# EAGLE design MPPC amp (EAGLE 7.1.0)
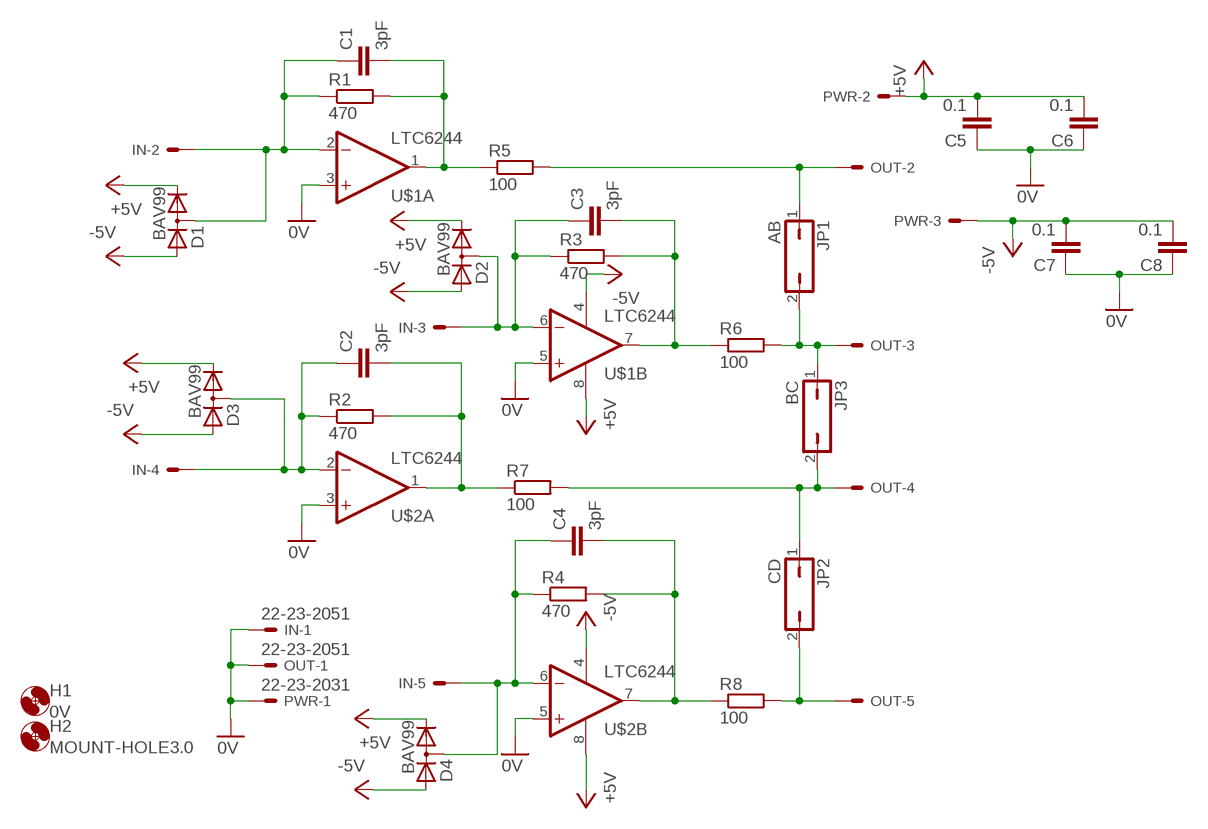
[diagram p0: schematic, sheet 1]

## Parts
C1  3pF  C-EUC0805  [C0805]
C2  3pF  C-EUC0805  [C0805]
C3  3pF  C-EUC0805  [C0805]
C4  3pF  C-EUC0805  [C0805]
C5  0.1  C-EUC0805  [C0805]
C6  0.1  C-EUC0805  [C0805]
C7  0.1  C-EUC0805  [C0805]
C8  0.1  C-EUC0805  [C0805]
D1  BAV99  [SOT23]
D2  BAV99  [SOT23]
D3  BAV99  [SOT23]
D4  BAV99  [SOT23]
H1  0V  MOUNT-HOLE3.0  [3,0]
H2  MOUNT-HOLE3.0  [3,0]
IN  22-23-2051  [22-23-2051]
JP1  AB  JP1Q  [JP1]
JP2  CD  JP1Q  [JP1]
JP3  BC  JP1Q  [JP1]
OUT  22-23-2051  [22-23-2051]
PWR  22-23-2031  [22-23-2031]
R1  470  R-EU_R0805  [R0805]
R2  470  R-EU_R0805  [R0805]
R3  470  R-EU_R0805  [R0805]
R4  470  R-EU_R0805  [R0805]
R5  100  R-EU_R0805  [R0805]
R6  100  R-EU_R0805  [R0805]
R7  100  R-EU_R0805  [R0805]
R8  100  R-EU_R0805  [R0805]
U$1  LTC6244  [MSOP08]
U$2  LTC6244  [MSOP08]

## Nets
0V: C5.1 C6.1 C7.1 C8.1 IN.1 OUT.1 PWR.1 U$1.3(A:+IN) U$1.5(B:+IN) U$2.3(A:+IN) U$2.5(B:+IN)
+5V: C5.2 C6.2 D1.2(C) D2.2(C) D3.2(C) D4.2(C) PWR.2 U$1.8(B:V+) U$2.8(B:V+)
-5V: C7.2 C8.2 D1.1(A) D2.1(A) D3.1(A) D4.1(A) PWR.3 U$1.4(B:V-) U$2.4(B:V-)
N$1: C4.1 D4.3(AC) IN.5 R4.1 U$2.6(B:-IN)
N$2: C2.1 D3.3(AC) IN.4 R2.1 U$2.2(A:-IN)
N$3: C3.1 D2.3(AC) IN.3 R3.1 U$1.6(B:-IN)
N$4: C1.1 D1.3(AC) IN.2 R1.1 U$1.2(A:-IN)
N$5: C1.2 R1.2 R5.1 U$1.1(A:OUT)
N$6: C2.2 R2.2 R7.1 U$2.1(A:OUT)
N$7: C3.2 R3.2 R6.1 U$1.7(B:OUT)
N$8: C4.2 R4.2 R8.1 U$2.7(B:OUT)
N$9: JP1.2 JP3.1 OUT.3 R6.2
N$10: JP1.1 OUT.2 R5.2
N$11: JP2.1 JP3.2 OUT.4 R7.2
N$12: JP2.2 OUT.5 R8.2

## Library data of the parts
C1-C8 = rcl:C-EU: CAPACITOR, European symbol
D1-D4 = custom_parts:BAV99: 200mA 70V High Conductance Ultra-fast Switching Diode
H1 H2 = holes:MOUNT-HOLE: MOUNTING HOLE with drill center marker
IN OUT = con-molex:22-23-2051: .100" (2.54mm) Center Header - 5 Pin; MF: MOLEX; MPN: 22-23-2051; OC_FARNELL: 1462952; OC_NEWARK: 38C9178
JP1-JP3 = jumper:JP1Q: JUMPER
PWR = con-molex:22-23-2031: .100" (2.54mm) Center Header - 3 Pin; MF: MOLEX; MPN: 22-23-2031; OC_FARNELL: 1462950; OC_NEWARK: 30C0862
R1-R8 = rcl:R-EU_: RESISTOR, European symbol
U$1 U$2 = custom_parts:LTC6244: Dual 50MHz, low noise, rail-to-rail, CMOS op amp

## Board
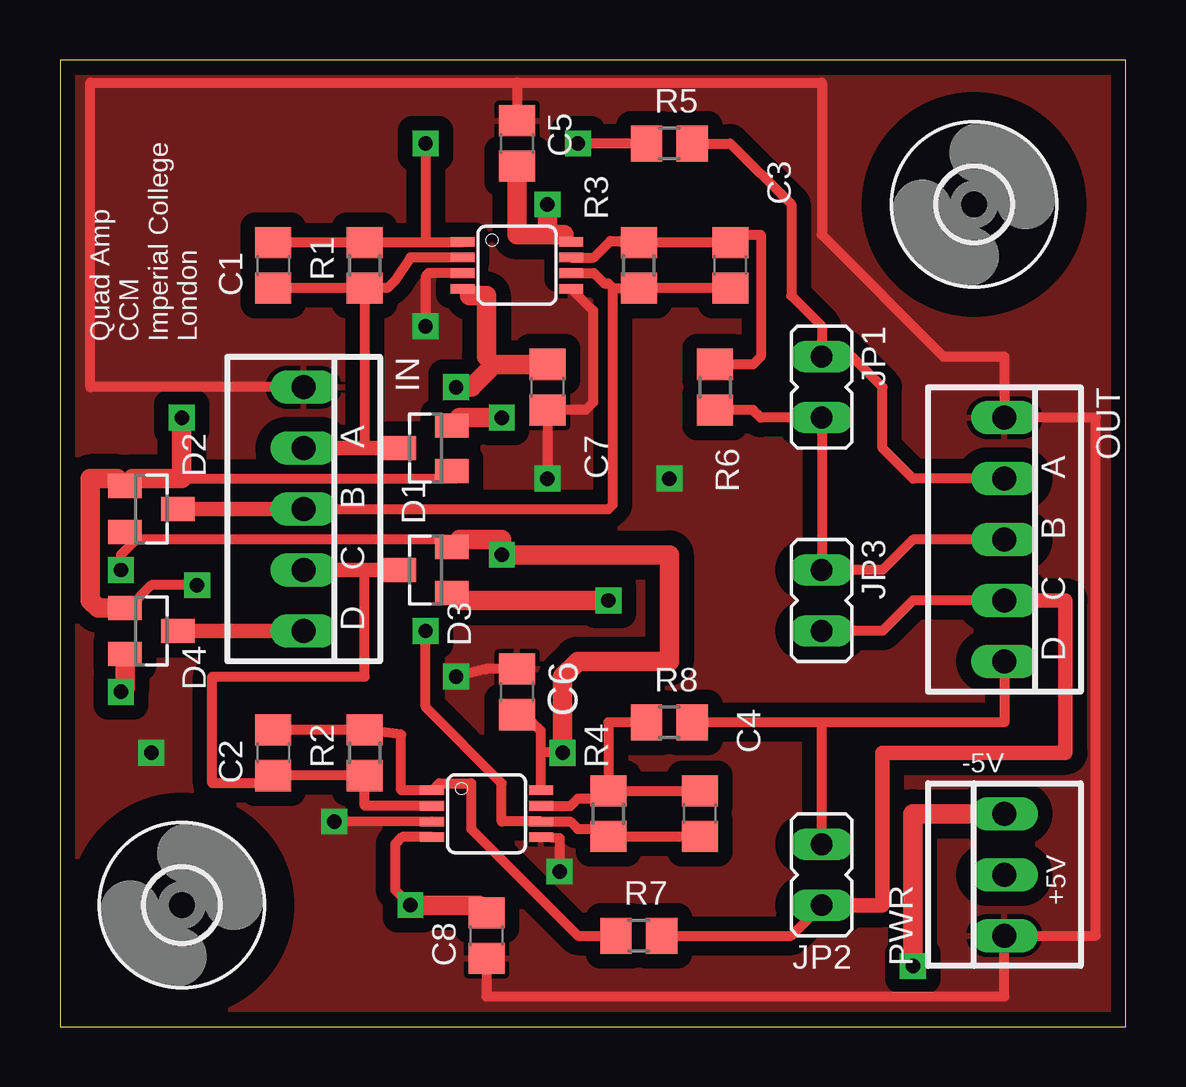
[diagram p1: board, top side]
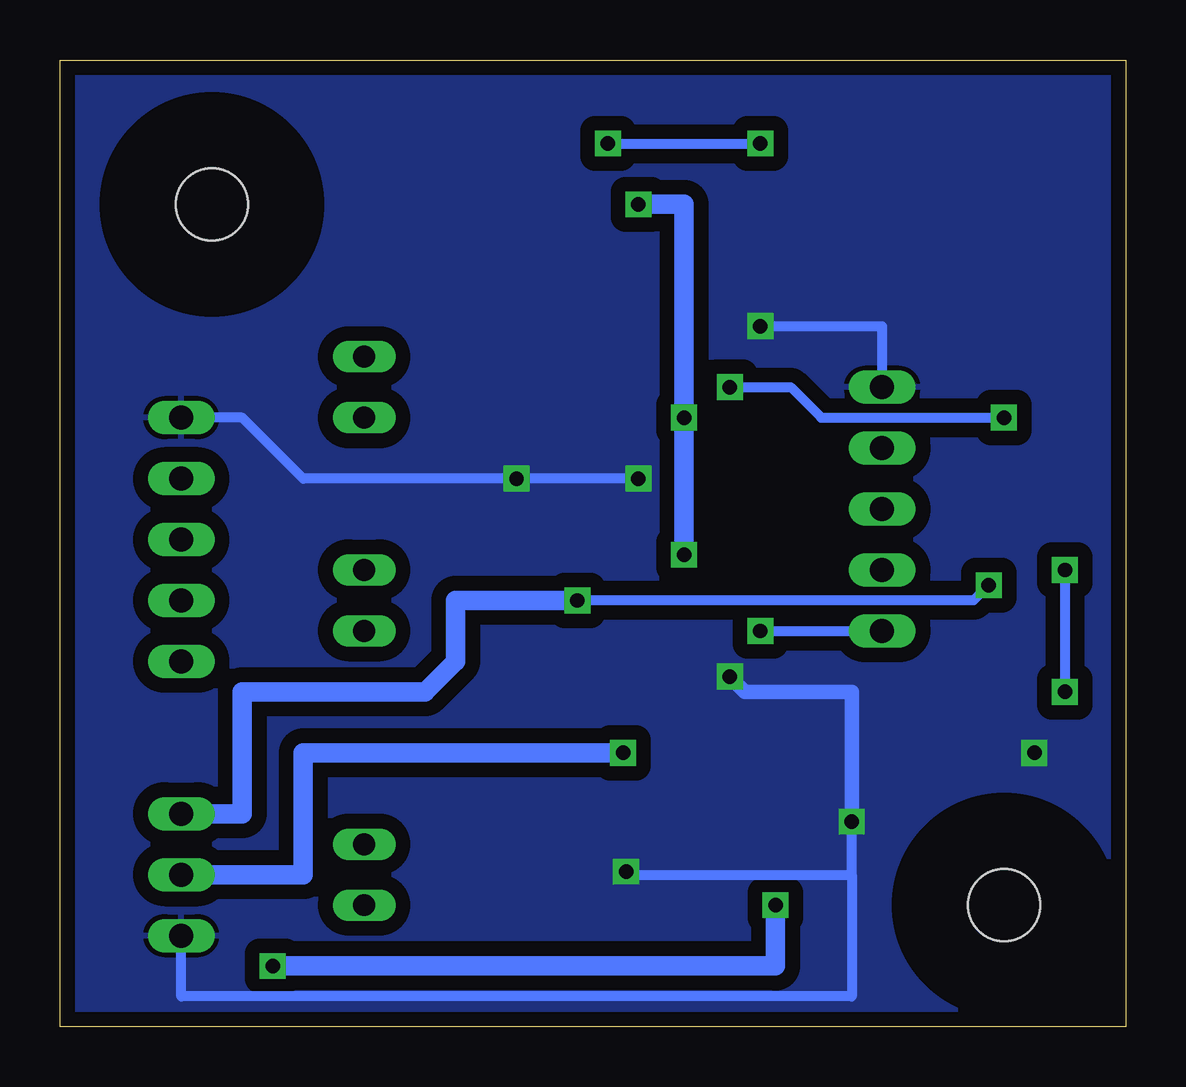
[diagram p2: board, bottom side, seen from below]

Size 44.43 x 40.31 mm. Coordinates in mm from the lower left corner, seen from the top.
Outline: 0,0 44.43,0 44.43,40.31 0,40.31 0,0
Copper layers (1*16): Top 0.035mm / dielectric 1.5mm / Bottom 0.035mm
Design rules "PCB-POOL Standard": minimum track width 0.15mm, minimum drill 0.3mm, track to track 0.15mm, track to pad 0.15mm, pad to pad 0.15mm, via to via 0.15mm, smd to smd 0.15mm, copper to edge 0.3mm, drill to drill 0.2mm, minimum pad ring 0.2mm, minimum via ring 0.15mm, stop-mask expansion 0.075mm, vias tented up to drill 0mil, thermal gap 0.2mm

### Footprints (pad centres in the part's own frame; a part is rotated, then mirrored left to right if it is on the bottom)
C0805 = smd 1.3 x 1.5: 1 -0.95,0; 2 0.95,0
SOT23 = smd 1 x 1.4: 1 -0.95,-1.1; 2 0.95,-1.1; 3 0,1.1
3,0 = hole 3: 0,0
22-23-2051 = drill 1 long: 1 -5.08,0; 2 -2.54,0; 3 0,0; 4 2.54,0; 5 5.08,0
JP1 = drill 0.914 long: 1 0,-1.27; 2 0,1.27
22-23-2031 = drill 1 long: 1 -2.54,0; 2 0,0; 3 2.54,0
R0805 = smd 1.3 x 1.5: 1 -0.95,0; 2 0.95,0
MSOP08 = smd 0.4 x 1: 1 -0.976,-2.263; 2 -0.326,-2.263; 3 0.324,-2.263; 4 0.974,-2.263; 5 0.974,2.262; 6 0.324,2.262; 7 -0.326,2.262; 8 -0.976,2.262

### Placement (x,y rotation side)
C1  8.89,31.75 90 top
C2  8.89,11.43 90 top
C3  27.94,31.75 90 top
C4  26.67,8.89 90 top
C5  19.05,36.83 270 top
C6  19.05,13.97 270 top
C7  20.32,26.67 90 top
C8  17.78,3.81 90 top
D1  15.24,24.13 90 top
D2  3.81,21.59 270 top
D3  15.24,19.05 90 top
D4  3.81,16.51 270 top
H1  5.08,5.08 0 top
H2  38.1,34.29 0 top
IN  10.16,21.59 270 top
JP1  31.75,26.67 180 top
JP2  31.75,6.35 0 top
JP3  31.75,17.78 180 top
OUT  39.37,20.32 270 top
PWR  39.37,6.35 90 top
R1  12.7,31.75 90 top
R2  12.7,11.43 90 top
R3  24.13,31.75 90 top
R4  22.86,8.89 90 top
R5  25.4,36.83 0 top
R6  27.3,26.67 270 top
R7  24.13,3.81 0 top
R8  25.4,12.7 0 top
U$1  19.05,31.75 270 top
U$2  17.78,8.89 270 top

### Tracks (layer width: path | path; a pad name or v marks a point on that pad's centre or on a via)
0V  (via drill 0.6)
  Top 0.406: U$2.3 v11.43,8.56 | U$2.5 20.83,7.87 v20.83,6.48 | C8.1 17.78,1.27 39.37,1.27 PWR.1 43.18,3.81 43.18,25.4 OUT.1 39.37,27.94 36.83,27.94 31.75,33.02 31.75,39.37 19.05,39.37 | IN.1 1.27,26.67 1.27,39.37 19.05,39.37 | 19.05,39.37 C5.1 | U$1.3 15.37,31.43 15.24,31.3 v15.24,29.21 | U$1.5 22.23,29.86 22.23,26.04 21.91,25.72 C7.1 v20.32,22.86 | C6.1 17.78,14.92 v16.51,14.61
  Bottom 0.406: v20.83,6.48 20.83,6.35 11.43,6.35 | v15.24,29.21 10.16,29.21 IN.1 | v20.32,22.86 v25.4,22.86 34.29,22.86 36.83,25.4 OUT.1 | 11.43,6.35 v11.43,8.56 | 11.43,6.35 11.43,1.27 39.37,1.27 PWR.1
  Bottom 0.61: v16.51,14.61 15.88,13.97 11.43,13.97 v11.43,8.56
  other vias: 3.81,11.43
  pour Bottom (isolate 0.61): 0,0 0,40.01 44.45,40.01 44.45,0
  pour Top (isolate 0.61): 0,0 0,40.01 44.45,40.01 44.45,0
+5V  (via drill 0.6)
  Top 0.406: U$2.8 20.04,11.47 | 20.04,11.47 20.04,12.34 19.68,12.7 19.37,12.7 C6.2 | 20.04,11.47 20.91,11.47 v20.95,11.43 | U$1.8 21.02,33.02 | 3.17,20.32 16.02,20.32 D3.2 16.66,20.32 | 3.17,20.32 2.85,20.64 D2.2 | 3.17,20.32 2.54,19.68 v2.54,19.05 | D1.2 16.66,25.4
  Top 0.813: 21.02,33.02 20.32,33.02 | C5.2 19.05,33.02 20.32,33.02 | 16.66,20.32 18.41,20.32 v18.41,19.68 25.4,19.68 25.4,15.24 21.59,15.24 20.95,14.61 v20.95,11.43 | v2.54,13.97 2.71,14.14 D4.2 | 16.66,25.4 v18.41,25.4 | 20.32,33.02 v20.32,34.29
  Bottom 0.406: v2.54,19.05 v2.54,13.97
  Bottom 0.813: v20.95,11.43 34.29,11.43 34.29,6.35 PWR.2 | v18.41,19.68 v18.41,25.4 18.41,34.29 v20.32,34.29
-5V  (via drill 0.6)
  Top 0.406: U$2.4 14.27,7.92 13.97,7.62 13.97,5.71 v14.61,5.08 | 17.46,5.08 C8.2 | U$1.4 17.08,30.48 | 17.78,27.94 18.1,27.62 | D2.1 3.03,22.86 | 5.08,22.86 16.51,22.86 16.34,23.03 D1.1 | D3.1 16.66,17.78 | v5.71,18.41 3.81,18.41 2.85,17.46 D4.1
  Top 0.813: v14.61,5.08 17.46,5.08 | v35.56,2.54 35.56,8.89 PWR.3 | 17.08,30.48 17.78,30.48 17.78,27.94 | C7.2 18.1,27.62 17.15,26.67 v16.51,26.67 | D2.1 2.39,22.86 1.27,22.86 1.27,17.78 1.59,17.46 D4.1 | 3.03,22.86 5.08,22.86 v5.08,25.4 | 16.66,17.78 v22.86,17.78
  Bottom 0.406: v5.71,18.41 6.35,17.78 v22.86,17.78 | v16.51,26.67 13.97,26.67 12.7,25.4 v5.08,25.4
  Bottom 0.813: v14.61,5.08 14.61,2.54 v35.56,2.54 | v22.86,17.78 27.94,17.78 27.94,15.24 29.21,13.97 36.83,13.97 36.83,8.89 PWR.3
N$1  (via drill 0.6)
  Top 0.406: C4.1 R4.1 22.55,8.26 21.59,8.26 21.28,8.57 U$2.6 18.41,8.56 18.41,10.16 15.24,13.34 v15.24,16.51
  Top 0.61: D4.3 IN.5
  Bottom 0.406: v15.24,16.51 IN.5
N$2
  Top 0.406: U$2.2 12.7,9.22 R2.1 C2.1 8.57,10.16 6.35,10.16 6.35,14.61 12.7,14.61 12.7,19.05
  Top 0.61: D3.3 12.7,19.05 IN.4
N$3
  Top 0.406: C3.1 R3.1 23.05,30.8 | U$1.6 22.26,31.43 22.7,30.99 22.86,30.99 23.05,30.8 | IN.3 22.86,21.59 23.05,21.78 23.05,30.8
  Top 0.61: D2.3 IN.3
N$4
  Top 0.406: U$1.2 14.61,32.08 13.97,31.11 13.65,30.8 R1.1 | R1.1 C1.1 | R1.1 12.7,24.13
  Top 0.61: D1.3 12.7,24.13 IN.2
N$5  (via drill 0.6)
  Top 0.406: U$1.1 16.76,32.7 15.24,32.7 | 15.24,32.7 R1.2 C1.2 | R5.1 v21.59,36.83 | v15.24,36.83 15.24,32.7
  Bottom 0.406: v21.59,36.83 v15.24,36.83
N$6
  Top 0.406: C2.2 R2.2 14.22,12.19 14.22,9.87 U$2.1 15.81,10.16 17.14,10.16 17.14,8.26 21.59,3.81 R7.1
N$7
  Top 0.406: U$1.7 22.26,32.08 22.94,32.77 23.37,32.77 23.43,32.7 R3.2 C3.2 28.26,33.02 29.21,33.02 29.21,27.94 28.89,27.62 R6.1
N$8
  Top 0.406: U$2.7 21.28,9.22 21.59,9.53 22.55,9.53 R4.2 | R4.2 C4.2 | R8.1 22.86,12.7 R4.2
N$9
  Top 0.406: OUT.3 35.56,20.32 34.29,19.05 JP3.1 JP1.2 29.21,25.4 28.89,25.72 R6.2
N$10
  Top 0.406: OUT.2 35.56,22.86 34.29,24.13 34.29,26.67 33.02,27.94 JP1.1 31.75,29.21 30.48,30.48 30.48,34.29 27.94,36.83 R5.2
N$11
  Top 0.406: R7.2 30.48,3.81 JP2.1 | OUT.4 35.56,17.78 34.29,16.51 JP3.2
  Top 0.61: JP2.1 34.29,5.08 34.29,11.43 41.91,11.43 41.91,17.78 OUT.4
N$12
  Top 0.406: JP2.2 31.75,12.7 | 31.75,12.7 R8.2 | OUT.5 39.37,12.7 31.75,12.7

### Text on the board
tNames: Quad Amp / CCM / Imperial College / London | A | A | B | B | C | C | D | D | -5V | +5V